# Altium schematic sheet GL852-2.SchDoc
size A4
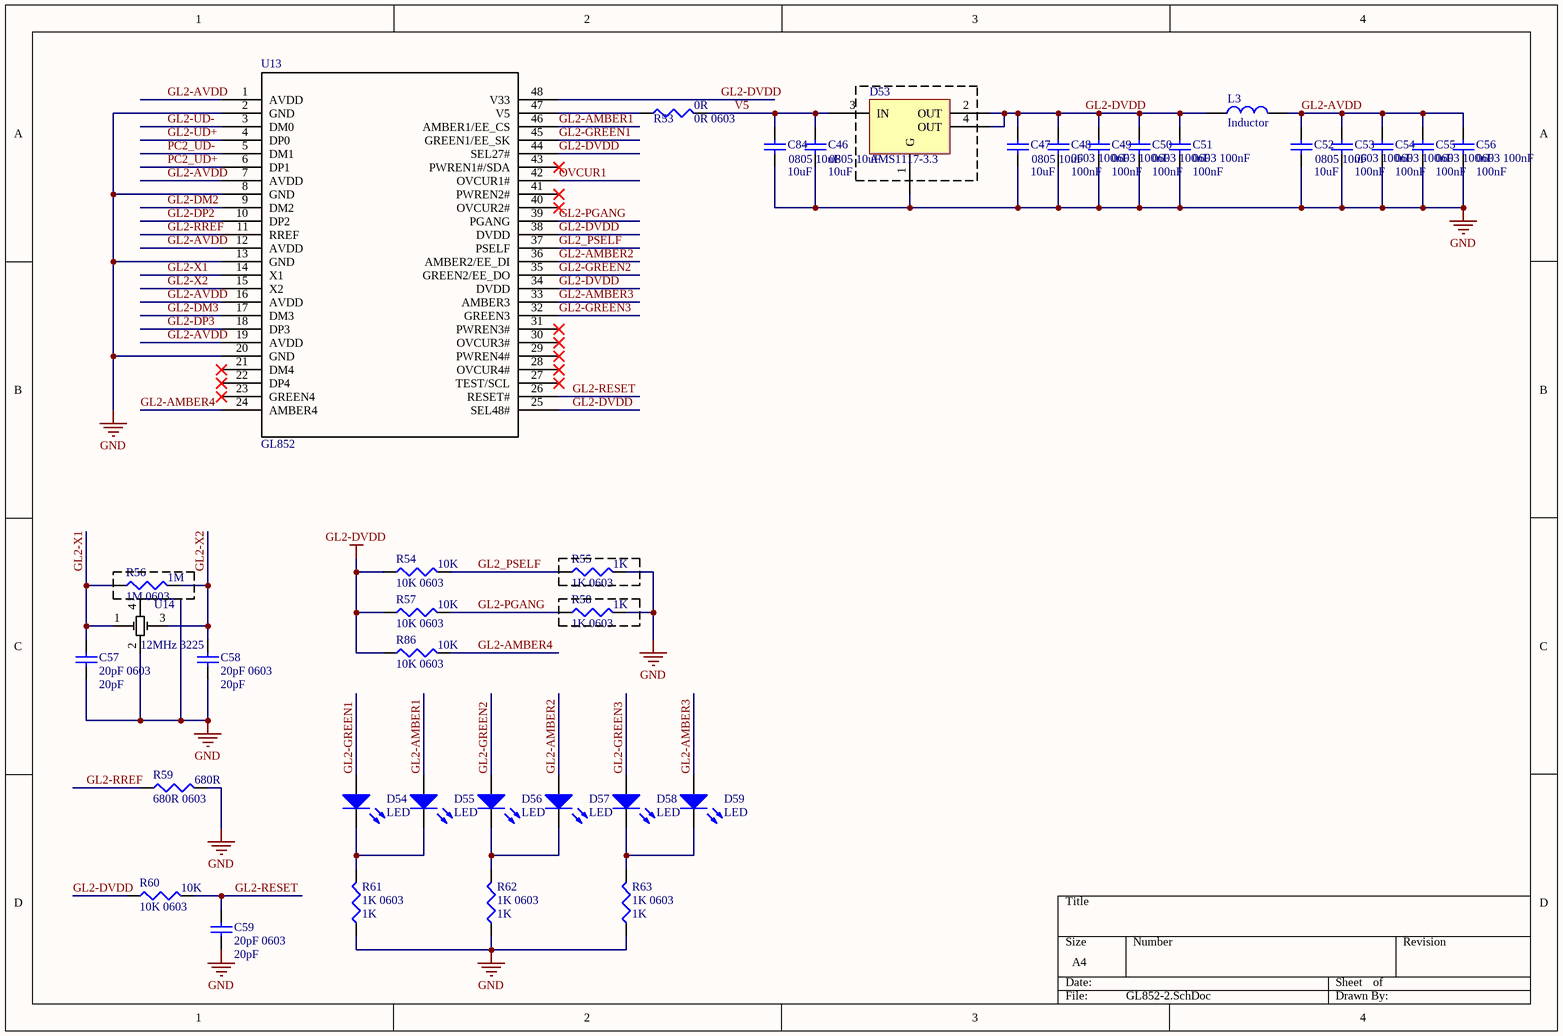
[diagram p0: GL852-2.SchDoc]

## Parts
C46  0805 10uF  value 10uF  [C0805]
C47  0805 10uF  value 10uF  [C0805]
C48  0603 100nF  value 100nF  [C0603]
C49  0603 100nF  value 100nF  [C0603]
C50  0603 100nF  value 100nF  [C0603]
C51  0603 100nF  value 100nF  [C0603]
C52  0805 10uF  value 10uF  [C0805]
C53  0603 100nF  value 100nF  [C0603]
C54  0603 100nF  value 100nF  [C0603]
C55  0603 100nF  value 100nF  [C0603]
C56  0603 100nF  value 100nF  [C0603]
C57  20pF 0603  value 20pF  [C0603]
C58  20pF 0603  value 20pF  [C0603]
C59  20pF 0603  value 20pF  [C0603]
C84  0805 10uF  value 10uF  [C0805]
D53  AMS1117-3.3  [SOT-223]
D54  LED  [LED0603]
D55  LED  [LED0603]
D56  LED  [LED0603]
D57  LED  [LED0603]
D58  LED  [LED0603]
D59  LED  [LED0603]
L3  Inductor  [L0603]
R53  0R 0603  value 0R  [R0603]
R54  10K 0603  value 10K  [R0603]
R55  1K 0603  value 1K  [R0603]
R56  1M 0603  value 1M  [R0603]
R57  10K 0603  value 10K  [R0603]
R58  1K 0603  value 1K  [R0603]
R59  680R 0603  value 680R  [R0603]
R60  10K 0603  value 10K  [R0603]
R61  1K 0603  value 1K  [R0603]
R62  1K 0603  value 1K  [R0603]
R63  1K 0603  value 1K  [R0603]
R86  10K 0603  value 10K  [R0603]
U13  GL852  [qfp48-20-0909b]
U14  12MHz 3225  [XTAL-3225]

## Nets
GL2-DVDD: C47.2 C48.2 C49.2 C50.2 C51.2 D53.2(OUT) D53.4(OUT) L3.1 R54.1 R57.1 R60.1 R86.1 U13.25(SEL48#) U13.34(DVDD) U13.38(DVDD) U13.44(SEL27#) U13.48(V33)
GND: C46.1 C47.1 C48.1 C49.1 C50.1 C51.1 C52.1 C53.1 C54.1 C55.1 C56.1 C57.1 C58.1 C59.1 C84.1 D53.1(G) R55.2 R58.2 R59.2 R61.1 R62.1 R63.1 U13.2(GND) U13.8(GND) U13.13(GND) U13.20(GND) U14.2 U14.4
GL2-AMBER1: D55.1(A) U13.46(AMBER1/EE_CS)
GL2-AMBER2: D57.1(A) U13.36(AMBER2/EE_DI)
GL2-AMBER3: D59.1(A) U13.33(AMBER3)
GL2-AMBER4: R86.2 U13.24(AMBER4)
GL2-AVDD: C52.2 C53.2 C54.2 C55.2 C56.2 L3.2 U13.1(AVDD) U13.7(AVDD) U13.12(AVDD) U13.16(AVDD) U13.19(AVDD)
GL2-DM2: U13.9(DM2)
GL2-DM3: U13.17(DM3)
GL2-DP2: U13.10(DP2)
GL2-DP3: U13.18(DP3)
GL2-GREEN1: D54.1(A) U13.45(GREEN1/EE_SK)
GL2-GREEN2: D56.1(A) U13.35(GREEN2/EE_DO)
GL2-GREEN3: D58.1(A) U13.32(GREEN3)
GL2-PGANG: R57.2 R58.1 U13.39(PGANG)
GL2-RESET: C59.2 R60.2 U13.26(RESET#)
GL2-RREF: R59.1 U13.11(RREF)
GL2-UD+: U13.4(DP0)
GL2-UD-: U13.3(DM0)
GL2-X1: C57.2 R56.1 U13.14(X1) U14.1
GL2-X2: C58.2 R56.2 U13.15(X2) U14.3
GL2_PSELF: R54.2 R55.1 U13.37(PSELF)
OVCUR1: U13.42(OVCUR1#)
PC2_UD+: U13.6(DP1)
PC2_UD-: U13.5(DM1)
V5: C46.2 C84.2 D53.3(IN) R53.2
NetD54_2: D54.2(K) D55.2(K) R61.2
NetD56_2: D56.2(K) D57.2(K) R62.2
NetD58_2: D58.2(K) D59.2(K) R63.2
NetR53_1: R53.1 U13.47(V5)

Not connected (* = marked no-connect by the designer): U13 21(DM4)* 22(DP4)* 23(GREEN4)* 27(TEST/SCL)* 28(OVCUR4#)* 29(PWREN4#)* 30(OVCUR3#)* 31(PWREN3#)* 40(OVCUR2#)* 41(PWREN2#)* 43(PWREN1#/SDA)*

## Library data of the parts
C46-C59 C84 = Cap Semi: Capacitor (Semiconductor SIM Model); Published: 8-Jun-2000; LatestRevisionDate: 29-May-2009; LatestRevisionNote: IPC-7351 Footprint Added.; PackageReference: C1206; Publisher: Altium Limited; PackageDescription: Chip Capacitor
R53-R63 R86 = Res3: Resistor; Published: 8-Jun-2000; LatestRevisionDate: 29-May-2009; LatestRevisionNote: IPC-7351 Footprint Added.; PackageReference: J1-0603; Publisher: Altium Limited; PackageDescription: Chip Resistor
U13 = GL852: Imported; Devide: GL852; RefDes: RefDes; Type: DEV; Value: Value
U14 = Component_1